# EAGLE schematic Stepper motor board (EAGLE 9.6.2)
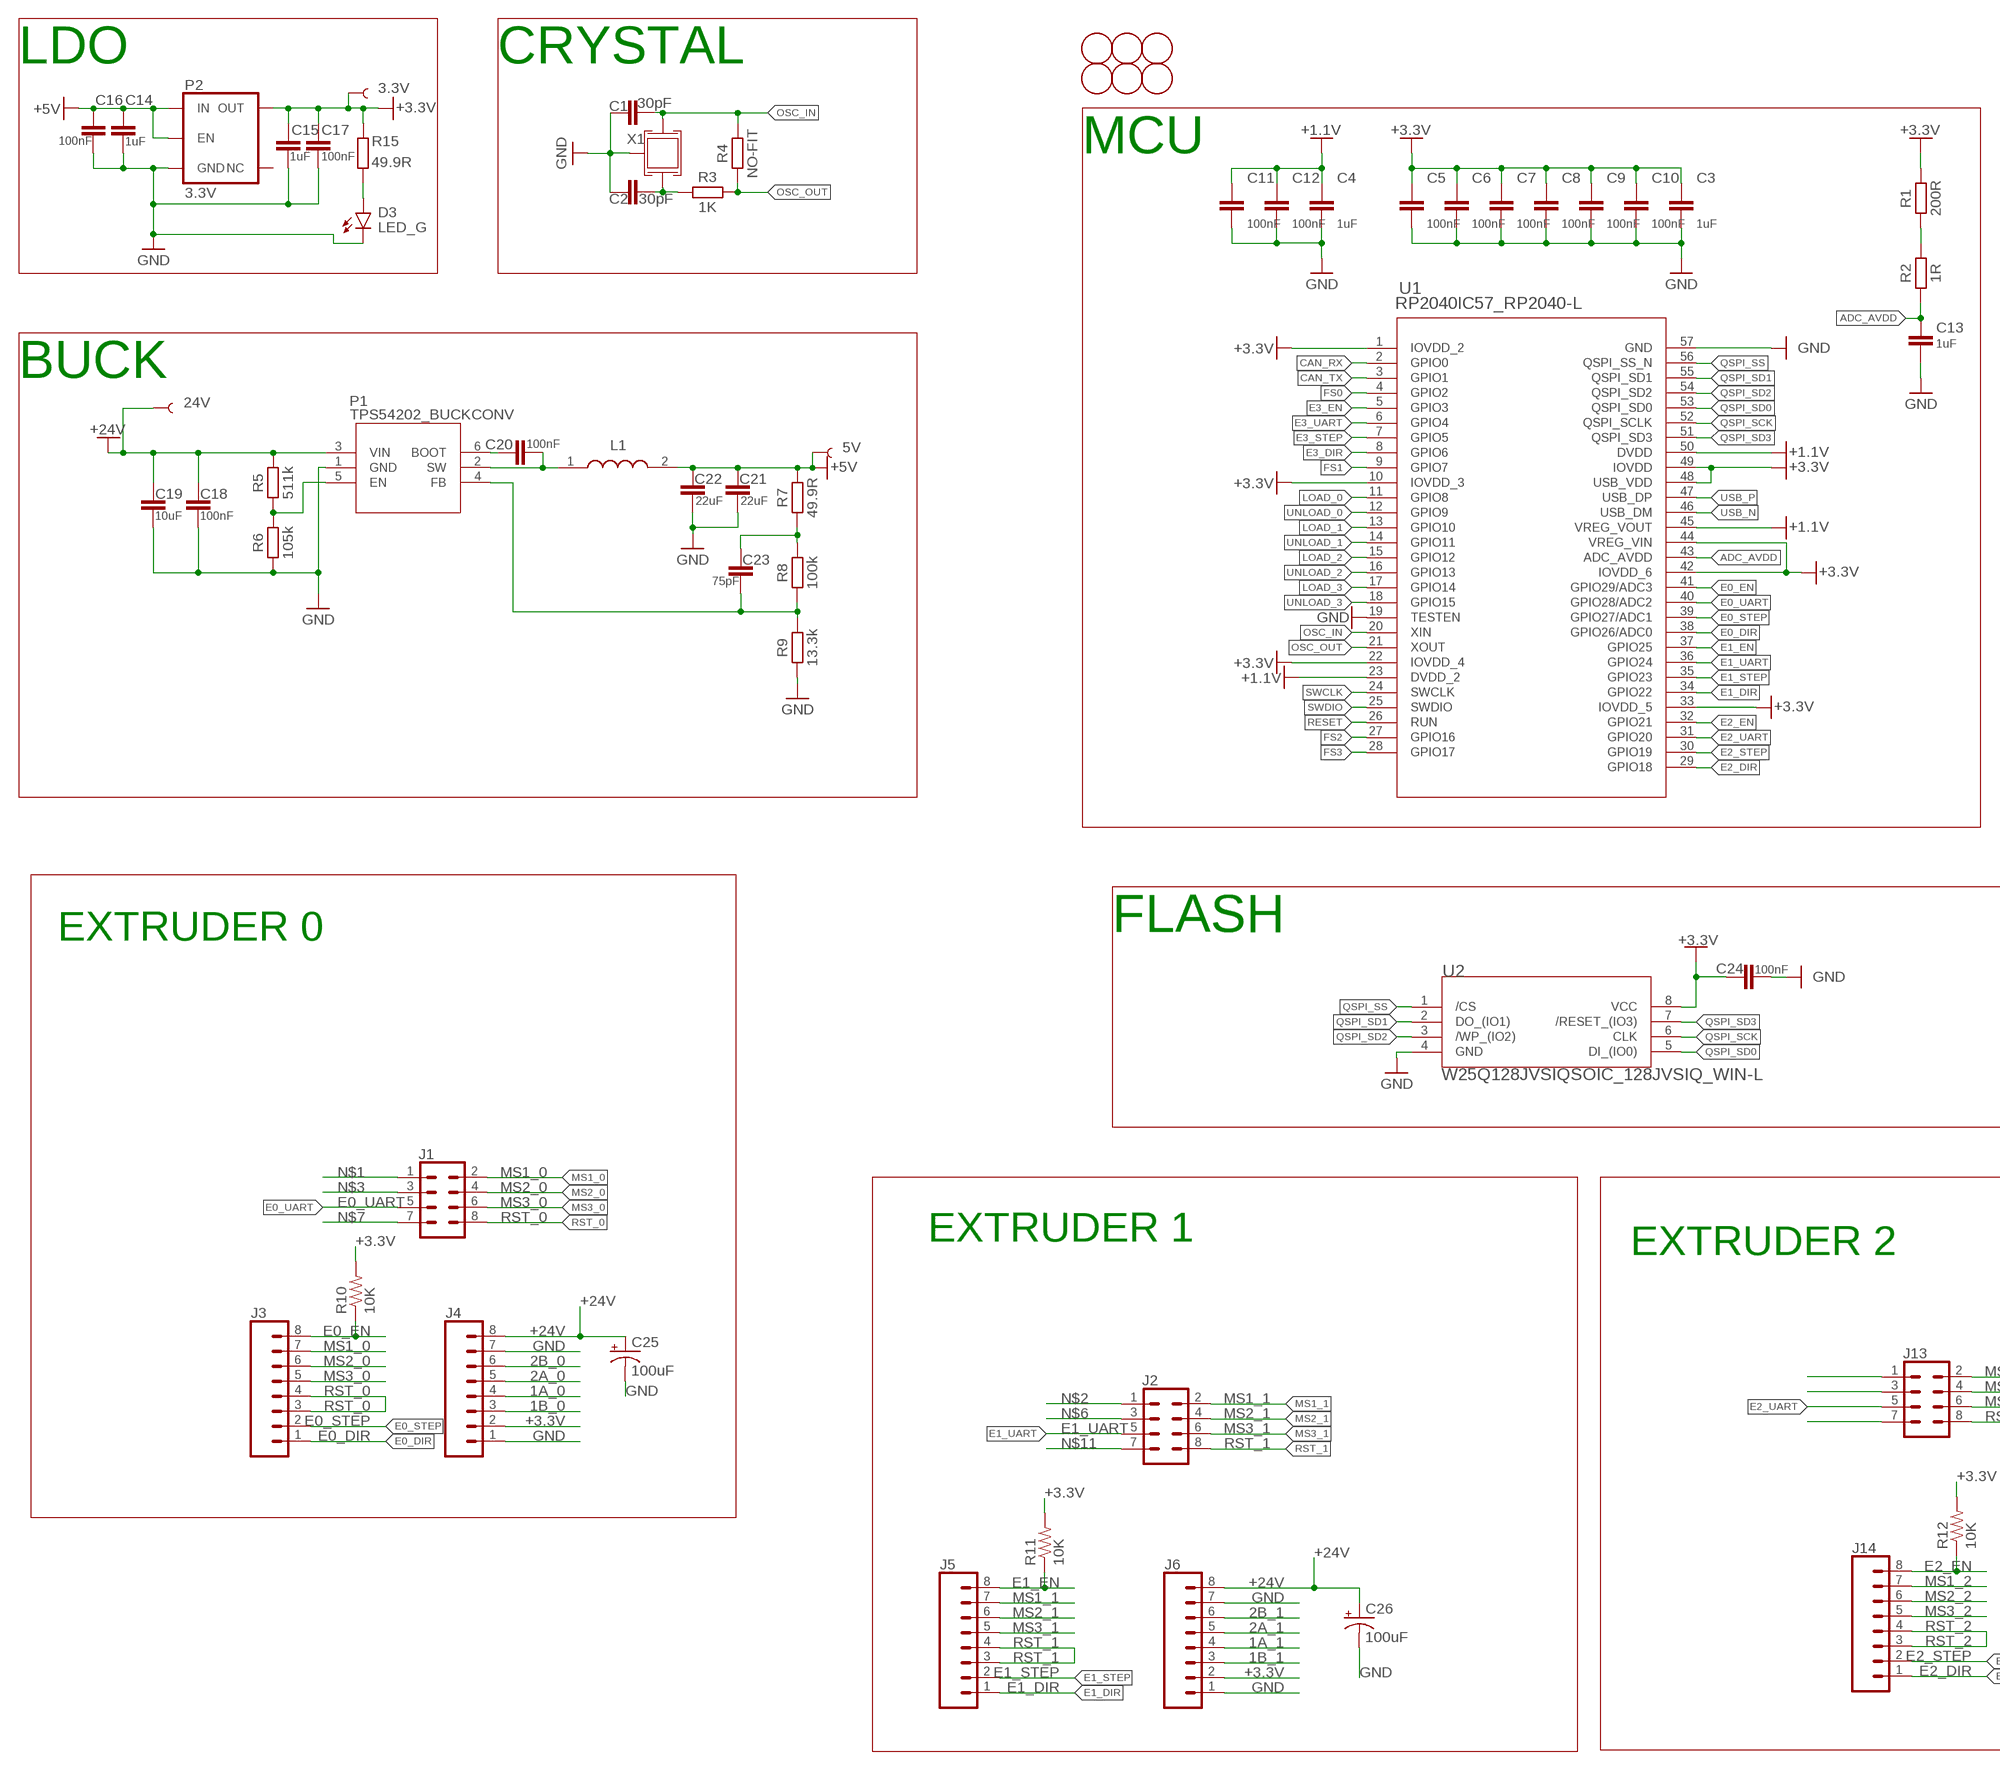
[diagram p0: schematic, sheet 1, part 1 of 2]
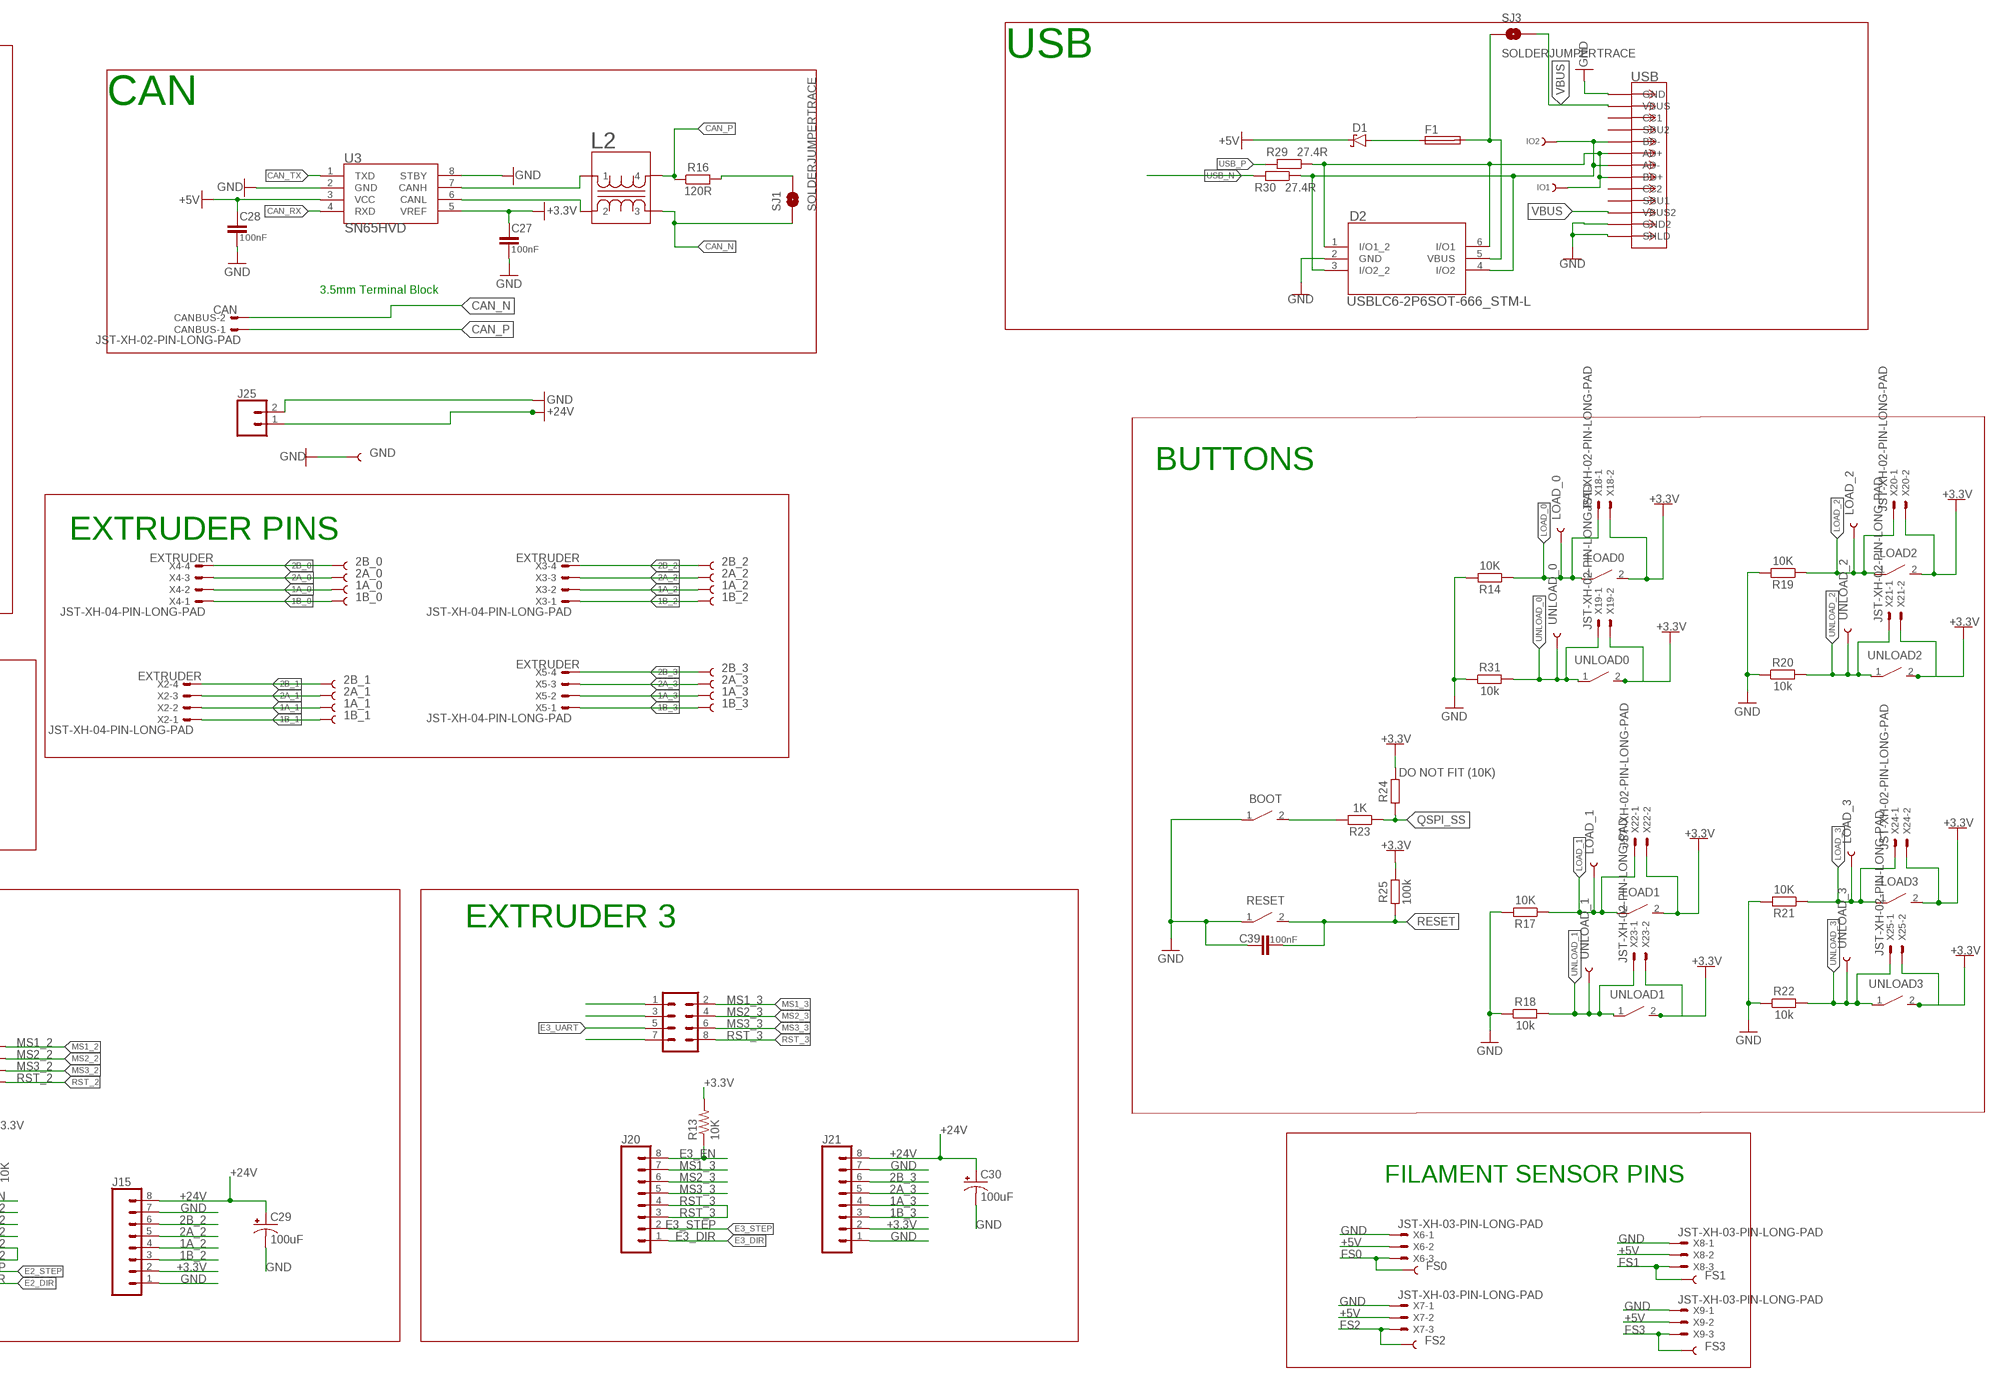
[diagram p1: schematic, sheet 1, part 2 of 2]

## Parts
1A_0  TEST-POINT3X4  [PAD.03X.04]
1A_1  TEST-POINT3X4  [PAD.03X.04]
1A_2  TEST-POINT3X4  [PAD.03X.04]
1A_3  TEST-POINT3X4  [PAD.03X.04]
1B_0  TEST-POINT3X4  [PAD.03X.04]
1B_1  TEST-POINT3X4  [PAD.03X.04]
1B_2  TEST-POINT3X4  [PAD.03X.04]
1B_3  TEST-POINT3X4  [PAD.03X.04]
2A_0  TEST-POINT3X4  [PAD.03X.04]
2A_1  TEST-POINT3X4  [PAD.03X.04]
2A_2  TEST-POINT3X4  [PAD.03X.04]
2A_3  TEST-POINT3X4  [PAD.03X.04]
2B_0  TEST-POINT3X4  [PAD.03X.04]
2B_1  TEST-POINT3X4  [PAD.03X.04]
2B_2  TEST-POINT3X4  [PAD.03X.04]
2B_3  TEST-POINT3X4  [PAD.03X.04]
3.3V  TEST-POINT3X4  [PAD.03X.04]
5V  TEST-POINT3X4  [PAD.03X.04]
24V  TEST-POINT3X4  [PAD.03X.04]
BOOT  B3U-1000P(M)-B  B3U-X000B3U-1000P(M)-B1000P(M)-B  [B3U-1000P(M)-B]
C1  30pF  C_CHIP-0402(1005-METRIC)  [CAPC1005X60]
C2  30pF  C_CHIP-0402(1005-METRIC)  [CAPC1005X60]
C3  1uF  C_CHIP-0402(1005-METRIC)  [CAPC1005X60]
C4  1uF  C_CHIP-0402(1005-METRIC)  [CAPC1005X60]
C5  100nF  C_CHIP-0402(1005-METRIC)  [CAPC1005X60]
C6  100nF  C_CHIP-0402(1005-METRIC)  [CAPC1005X60]
C7  100nF  C_CHIP-0402(1005-METRIC)  [CAPC1005X60]
C8  100nF  C_CHIP-0402(1005-METRIC)  [CAPC1005X60]
C9  100nF  C_CHIP-0402(1005-METRIC)  [CAPC1005X60]
C10  100nF  C_CHIP-0402(1005-METRIC)  [CAPC1005X60]
C11  100nF  C_CHIP-0402(1005-METRIC)  [CAPC1005X60]
C12  100nF  C_CHIP-0402(1005-METRIC)  [CAPC1005X60]
C13  1uF  C_CHIP-0402(1005-METRIC)  [CAPC1005X60]
C14  1uF  C_CHIP-0402(1005-METRIC)  [CAPC1005X60]
C15  1uF  C_CHIP-0402(1005-METRIC)  [CAPC1005X60]
C16  100nF  C_CHIP-0402(1005-METRIC)  [CAPC1005X60]
C17  100nF  C_CHIP-0402(1005-METRIC)  [CAPC1005X60]
C18  100nF  C_CHIP-0402(1005-METRIC)  [CAPC1005X60]
C19  10uF  C_CHIP-0603(1608-METRIC)  [CAPC1608X85]
C20  100nF  C_CHIP-0402(1005-METRIC)  [CAPC1005X60]
C21  22uF  C_CHIP-0805(2012-METRIC)  [CAPC2012X110]
C22  22uF  C_CHIP-0805(2012-METRIC)  [CAPC2012X110]
C23  75pF  C_CHIP-0402(1005-METRIC)  [CAPC1005X60]
C24  100nF  C_CHIP-0402(1005-METRIC)  [CAPC1005X60]
C25  100uF  100UF-POLAR-25V-20%(ELEC)  [PANASONIC_D]
C26  100uF  100UF-POLAR-25V-20%(ELEC)  [PANASONIC_D]
C27  100nF  C_CHIP-0402(1005-METRIC)  [CAPC1005X60]
C28  100nF  C_CHIP-0402(1005-METRIC)  [CAPC1005X60]
C29  100uF  100UF-POLAR-25V-20%(ELEC)  [PANASONIC_D]
C30  100uF  100UF-POLAR-25V-20%(ELEC)  [PANASONIC_D]
C39  100nF  C_CHIP-0402(1005-METRIC)  [CAPC1005X60]
CANBUS  JST-XH-02-PIN-LONG-PAD  [JST-XH-02-PACKAGE-LONG-PAD]
D1  MBR0520LT1G  SCHOTTKY_MBR0520LT1GDO-219  [SODFL3718X115]
D2  USBLC6-2P6SOT-666_STM-L  [SOT-666_STM-L]
D3  LED_G  CHIP-FLAT-G_0603-0.35MM  [LEDC1608X35N_FLAT-G]
F1  FUSE_CHIP-0603(1608-METRIC)  [FUSC1608X60N]
FD1  FIDUCIAL  [FIDUCIAL_1MM]
FD2  FIDUCIAL  [FIDUCIAL_1MM]
FD3  FIDUCIAL  [FIDUCIAL_1MM]
FD4  FIDUCIAL  [FIDUCIAL_1MM]
FD5  FIDUCIAL  [FIDUCIAL_1MM]
FD6  FIDUCIAL  [FIDUCIAL_1MM]
FS0  TEST-POINT3X4  [PAD.03X.04]
FS1  TEST-POINT3X4  [PAD.03X.04]
FS2  TEST-POINT3X4  [PAD.03X.04]
FS3  TEST-POINT3X4  [PAD.03X.04]
GND  TEST-POINT3X4  [PAD.03X.04]
IO1  TEST-POINT3  [PAD.03X.03]
IO2  TEST-POINT3  [PAD.03X.03]
J1  CONN_04X2  [2X4]
J2  CONN_04X2  [2X4]
J3  CONN_08"  [1X08]
J4  CONN_08"  [1X08]
J5  CONN_08"  [1X08]
J6  CONN_08"  [1X08]
J13  CONN_04X2  [2X4]
J14  CONN_08"  [1X08]
J15  CONN_08"  [1X08]
J19  CONN_04X2  [2X4]
J20  CONN_08"  [1X08]
J21  CONN_08"  [1X08]
J25  CONN_023.5MM  [SCREWTERMINAL-3.5MM-2]
L1  ASPI-0630HI-100M-T157X7X4  [SMDRI74-680MT]
L2  ACM2012  ACM2012-201-2P-T002ACM2012_TDK  [ACM2012_TDK]
LOAD0  B3U-1000P(M)-B  B3U-X000B3U-1000P(M)-B1000P(M)-B  [B3U-1000P(M)-B]
LOAD1  B3U-1000P(M)-B  B3U-X000B3U-1000P(M)-B1000P(M)-B  [B3U-1000P(M)-B]
LOAD2  B3U-1000P(M)-B  B3U-X000B3U-1000P(M)-B1000P(M)-B  [B3U-1000P(M)-B]
LOAD3  B3U-1000P(M)-B  B3U-X000B3U-1000P(M)-B1000P(M)-B  [B3U-1000P(M)-B]
LOAD_0  TEST-POINT3X4  [PAD.03X.04]
LOAD_1  TEST-POINT3X4  [PAD.03X.04]
LOAD_2  TEST-POINT3X4  [PAD.03X.04]
LOAD_3  TEST-POINT3X4  [PAD.03X.04]
P1  TPS54202_BUCKCONV  [SOT-23-6]
P2  3.3V  V_REG_AP2112K-3.3V  [SOT23-5]
R1  200R  R_CHIP-0402(1005-METRIC)  [RESC1005X40]
R2  1R  R_CHIP-0402(1005-METRIC)  [RESC1005X40]
R3  1K  R_CHIP-0402(1005-METRIC)  [RESC1005X40]
R4  NO-FIT  R_CHIP-0402(1005-METRIC)  [RESC1005X40]
R5  511k  R_CHIP-0402(1005-METRIC)  [RESC1005X40]
R6  105k  R_CHIP-0402(1005-METRIC)  [RESC1005X40]
R7  49.9R  R_CHIP-0402(1005-METRIC)  [RESC1005X40]
R8  100k  R_CHIP-0402(1005-METRIC)  [RESC1005X40]
R9  13.3k  R_CHIP-0402(1005-METRIC)  [RESC1005X40]
R10  10K  10KOHM1/10W1%(0603)0603  [0603-RES]
R11  10K  10KOHM1/10W1%(0603)0603  [0603-RES]
R12  10K  10KOHM1/10W1%(0603)0603  [0603-RES]
R13  10K  10KOHM1/10W1%(0603)0603  [0603-RES]
R14  10K  R_CHIP-0402(1005-METRIC)  [RESC1005X40]
R15  49.9R  R_CHIP-0402(1005-METRIC)  [RESC1005X40]
R16  120R  R_CHIP-0402(1005-METRIC)  [RESC1005X40]
R17  10K  R_CHIP-0402(1005-METRIC)  [RESC1005X40]
R18  10k  R_CHIP-0402(1005-METRIC)  [RESC1005X40]
R19  10K  R_CHIP-0402(1005-METRIC)  [RESC1005X40]
R20  10k  R_CHIP-0402(1005-METRIC)  [RESC1005X40]
R21  10K  R_CHIP-0402(1005-METRIC)  [RESC1005X40]
R22  10k  R_CHIP-0402(1005-METRIC)  [RESC1005X40]
R23  1K  R_CHIP-0402(1005-METRIC)  [RESC1005X40]
R24  DO NOT FIT (10K)  R_CHIP-0402(1005-METRIC)  [RESC1005X40]
R25  100k  R_CHIP-0402(1005-METRIC)  [RESC1005X40]
R29  27.4R  R_CHIP-0402(1005-METRIC)  [RESC1005X40]
R30  27.4R  R_CHIP-0402(1005-METRIC)  [RESC1005X40]
R31  10k  R_CHIP-0402(1005-METRIC)  [RESC1005X40]
RESET  B3U-1000P(M)-B  B3U-X000B3U-1000P(M)-B1000P(M)-B  [B3U-1000P(M)-B]
SJ1  SOLDERJUMPERTRACE  [SJ_2S-TRACE]
SJ3  SOLDERJUMPERTRACE  [SJ_2S-TRACE]
U1  RP2040IC57_RP2040-L  [IC57_RP2040-L]
U2  W25Q128JVSIQSOIC_128JVSIQ_WIN-L  [SOIC_128JVSIQ_WIN-L]
U3  SN65HVD  SN65HVD1050DRD8-L  [D8-L]
UNLOAD0  B3U-1000P(M)-B  B3U-X000B3U-1000P(M)-B1000P(M)-B  [B3U-1000P(M)-B]
UNLOAD1  B3U-1000P(M)-B  B3U-X000B3U-1000P(M)-B1000P(M)-B  [B3U-1000P(M)-B]
UNLOAD2  B3U-1000P(M)-B  B3U-X000B3U-1000P(M)-B1000P(M)-B  [B3U-1000P(M)-B]
UNLOAD3  B3U-1000P(M)-B  B3U-X000B3U-1000P(M)-B1000P(M)-B  [B3U-1000P(M)-B]
UNLOAD_0  TEST-POINT3X4  [PAD.03X.04]
UNLOAD_1  TEST-POINT3X4  [PAD.03X.04]
UNLOAD_2  TEST-POINT3X4  [PAD.03X.04]
UNLOAD_3  TEST-POINT3X4  [PAD.03X.04]
USB  USB-C(KH-TYPE-C-16P)  [CONN12_KH-TYPE-C-16P]
X1  CRYSTAL_TAXM12M4RLBDDT2T_3225  [CRYSTAL_3225]
X2  JST-XH-04-PIN-LONG-PAD  [JST-XH-04-PACKAGE-LONG-PAD]
X3  JST-XH-04-PIN-LONG-PAD  [JST-XH-04-PACKAGE-LONG-PAD]
X4  JST-XH-04-PIN-LONG-PAD  [JST-XH-04-PACKAGE-LONG-PAD]
X5  JST-XH-04-PIN-LONG-PAD  [JST-XH-04-PACKAGE-LONG-PAD]
X6  JST-XH-03-PIN-LONG-PAD  [JST-XH-03-PACKAGE-LONG-PAD]
X7  JST-XH-03-PIN-LONG-PAD  [JST-XH-03-PACKAGE-LONG-PAD]
X8  JST-XH-03-PIN-LONG-PAD  [JST-XH-03-PACKAGE-LONG-PAD]
X9  JST-XH-03-PIN-LONG-PAD  [JST-XH-03-PACKAGE-LONG-PAD]
X18  JST-XH-02-PIN-LONG-PAD  [JST-XH-02-PACKAGE-LONG-PAD]
X19  JST-XH-02-PIN-LONG-PAD  [JST-XH-02-PACKAGE-LONG-PAD]
X20  JST-XH-02-PIN-LONG-PAD  [JST-XH-02-PACKAGE-LONG-PAD]
X21  JST-XH-02-PIN-LONG-PAD  [JST-XH-02-PACKAGE-LONG-PAD]
X22  JST-XH-02-PIN-LONG-PAD  [JST-XH-02-PACKAGE-LONG-PAD]
X23  JST-XH-02-PIN-LONG-PAD  [JST-XH-02-PACKAGE-LONG-PAD]
X24  JST-XH-02-PIN-LONG-PAD  [JST-XH-02-PACKAGE-LONG-PAD]
X25  JST-XH-02-PIN-LONG-PAD  [JST-XH-02-PACKAGE-LONG-PAD]

## Nets
1A_0: 1A_0.P$1 J4.4 X4.2
1A_1: 1A_1.P$1 J6.4 X2.2
1A_2: 1A_2.P$1 J15.4 X3.2
1A_3: 1A_3.P$1 J21.4 X5.2
1B_0: 1B_0.P$1 J4.3 X4.1
1B_1: 1B_1.P$1 J6.3 X2.1
1B_2: 1B_2.P$1 J15.3 X3.1
1B_3: 1B_3.P$1 J21.3 X5.1
2A_0: 2A_0.P$1 J4.5 X4.3
2A_1: 2A_1.P$1 J6.5 X2.3
2A_2: 2A_2.P$1 J15.5 X3.3
2A_3: 2A_3.P$1 J21.5 X5.3
2B_0: 2B_0.P$1 J4.6 X4.4
2B_1: 2B_1.P$1 J6.6 X2.4
2B_2: 2B_2.P$1 J15.6 X3.4
2B_3: 2B_3.P$1 J21.6 X5.4
+1.1V [POWER]: C4.1 C11.1 C12.1 U1.23(DVDD_2) U1.45(VREG_VOUT) U1.50(DVDD)
+3.3V [POWER]: 3.3V.P$1 C3.1 C5.1 C6.1 C7.1 C8.1 C9.1 C10.1 C15.1 C17.1 C24.1 C27.1 J4.2 J6.2 J15.2 J21.2 LOAD0.2 LOAD1.2 LOAD2.2 LOAD3.2 P2.5(OUT) R1.2 R10.2 R11.2 R12.2 R13.2 R15.2 R24.2 R25.2 U1.1(IOVDD_2) U1.10(IOVDD_3) U1.22(IOVDD_4) U1.33(IOVDD_5) U1.42(IOVDD_6) U1.44(VREG_VIN) U1.48(USB_VDD) U1.49(IOVDD) U2.8(VCC) U3.5(VREF) UNLOAD0.2 UNLOAD1.2 UNLOAD2.2 UNLOAD3.2 X18.2 X19.2 X20.2 X21.2 X22.2 X23.2 X24.2 X25.2
+5V [POWER]: 5V.P$1 C14.1 C16.1 C21.1 C22.1 C28.1 D1.1(C) L1.2 P2.1(IN) P2.3(EN) R7.2 U3.3(VCC) X6.2 X7.2 X8.2 X9.2
+24V [POWER]: 24V.P$1 C18.1 C19.1 C25.+ C26.+ C29.+ C30.+ J4.8 J6.8 J15.8 J21.8 J25.1 P1.3(VIN) R5.2
ADC_AVDD: C13.1 R2.1 U1.43(ADC_AVDD)
ADC_R: R1.1 R2.2
BCBOOT: C20.1 P1.6(BOOT)
CAN1_N [DIFF]: L2.2 U3.6(CANL)
CAN1_P [DIFF]: L2.1 U3.7(CANH)
CAN_N [DIFF]: CANBUS.2 L2.3 SJ1.1
CAN_P [DIFF]: CANBUS.1 L2.4 R16.1
CAN_RX: U1.2(GPIO0) U3.4(RXD)
CAN_TX: U1.3(GPIO1) U3.1(TXD)
CNT: R16.2 SJ1.2
E0_DIR: J3.1 U1.38(GPIO26/ADC0)
E0_EN: J3.8 R10.1 U1.41(GPIO29/ADC3)
E0_STEP: J3.2 U1.39(GPIO27/ADC1)
E0_UART: J1.5 U1.40(GPIO28/ADC2)
E1_DIR: J5.1 U1.34(GPIO22)
E1_EN: J5.8 R11.1 U1.37(GPIO25)
E1_STEP: J5.2 U1.35(GPIO23)
E1_UART: J2.5 U1.36(GPIO24)
E2_DIR: J14.1 U1.29(GPIO18)
E2_EN: J14.8 R12.1 U1.32(GPIO21)
E2_STEP: J14.2 U1.30(GPIO19)
E2_UART: J13.5 U1.31(GPIO20)
E3_DIR: J20.1 U1.8(GPIO6)
E3_EN: J20.8 R13.1 U1.5(GPIO3)
E3_STEP: J20.2 U1.7(GPIO5)
E3_UART: J19.5 U1.6(GPIO4)
FS0: FS0.P$1 U1.4(GPIO2) X6.3
FS1: FS1.P$1 U1.9(GPIO7) X8.3
FS2: FS2.P$1 U1.27(GPIO16) X7.3
FS3: FS3.P$1 U1.28(GPIO17) X9.3
GND [POWER]: BOOT.1 C1.2 C2.1 C3.2 C4.2 C5.2 C6.2 C7.2 C8.2 C9.2 C10.2 C11.2 C12.2 C13.2 C14.2 C15.2 C16.2 C17.2 C18.2 C19.2 C21.2 C22.2 C24.2 C25.- C26.- C27.2 C28.2 C29.- C30.- C39.1 D2.2(GND) D3.C GND.P$1 J4.1 J4.7 J6.1 J6.7 J15.1 J15.7 J21.1 J21.7 J25.2 P1.1(GND) P2.2(GND) R6.1 R9.1 R14.2 R17.2 R18.1 R19.2 R20.1 R21.2 R22.1 R31.1 RESET.1 U1.19(TESTEN) U1.57(GND) U2.4(GND) U3.2(GND) U3.8(STBY) USB.1(GND) USB.12(GND2) USB.13(SHLD) USB.14(SHLD) USB.15(SHLD) USB.16(SHLD) USB.18(SHLD) USB.19(SHLD) USB.20(SHLD) USB.21(SHLD) USB.24(SHLD) USB.25(SHLD) USB.26(SHLD) USB.27(SHLD) USB.28(SHLD) USB.29(SHLD) USB.37(SHLD) USB.39(SHLD) USB.41(SHLD) USB.43(SHLD) X1.P$2(GND) X1.P$4(GND) X6.1 X7.1 X8.1 X9.1
LDOLED: D3.A R15.1
LOAD_0: LOAD0.1 LOAD_0.P$1 R14.1 U1.11(GPIO8) X18.1
LOAD_1: LOAD1.1 LOAD_1.P$1 R17.1 U1.13(GPIO10) X22.1
LOAD_2: LOAD2.1 LOAD_2.P$1 R19.1 U1.15(GPIO12) X20.1
LOAD_3: LOAD3.1 LOAD_3.P$1 R21.1 U1.17(GPIO14) X24.1
MS1_0: J1.2 J3.7
MS1_1: J2.2 J5.7
MS1_2: J13.2 J14.7
MS1_3: J19.2 J20.7
MS2_0: J1.4 J3.6
MS2_1: J2.4 J5.6
MS2_2: J13.4 J14.6
MS2_3: J19.4 J20.6
MS3_0: J1.6 J3.5
MS3_1: J2.6 J5.5
MS3_2: J13.6 J14.5
MS3_3: J19.6 J20.5
N$1: J1.1
N$2: J2.1
N$3: J1.3
N$4: J13.1
N$6: J2.3
N$7: J1.7
N$8: J13.3
N$11: J2.7
N$12: J13.7
N$14: J19.1
N$15: J19.3
N$17: J19.7
OSC_IN: C1.1 R4.2 U1.20(XIN) X1.P$1(P1)
OSC_OUT: R3.2 R4.1 U1.21(XOUT)
QSPI_SCK: U1.52(QSPI_SCLK) U2.6(CLK)
QSPI_SD0: U1.53(QSPI_SD0) U2.5(DI_(IO0))
QSPI_SD1: U1.55(QSPI_SD1) U2.2(DO_(IO1))
QSPI_SD2: U1.54(QSPI_SD2) U2.3(/WP_(IO2))
QSPI_SD3: U1.51(QSPI_SD3) U2.7(/RESET_(IO3))
QSPI_SS: R23.1 R24.1 U1.56(QSPI_SS_N) U2.1(/CS)
RESET: C39.2 R25.1 RESET.2 U1.26(RUN)
RST_0: J1.8 J3.3 J3.4
RST_1: J2.8 J5.3 J5.4
RST_2: J13.8 J14.3 J14.4
RST_3: J19.8 J20.3 J20.4
SWB: BOOT.2 R23.2
SWCLK: U1.24(SWCLK)
SWDIO: U1.25(SWDIO)
UNLOAD_0: R31.2 U1.12(GPIO9) UNLOAD0.1 UNLOAD_0.P$1 X19.1
UNLOAD_1: R18.2 U1.14(GPIO11) UNLOAD1.1 UNLOAD_1.P$1 X23.1
UNLOAD_2: R20.2 U1.16(GPIO13) UNLOAD2.1 UNLOAD_2.P$1 X21.1
UNLOAD_3: R22.2 U1.18(GPIO15) UNLOAD3.1 UNLOAD_3.P$1 X25.1
USB1_N [DIFF]: D2.3(I/O2_2) D2.4(I/O2) IO2.P$1 R30.1 USB.5(BD-) USB.7(AD-)
USB1_P [DIFF]: D2.1(I/O1_2) D2.6(I/O1) IO1.P$1 R29.1 USB.6(AD+) USB.8(BD+)
USB_N [DIFF]: R30.2 U1.46(USB_DM)
USB_P [DIFF]: R29.2 U1.47(USB_DP)
VBUS [POWER]: SJ3.2 USB.2(VBUS) USB.11(VBUS2)
VBUS1 [POWER]: D2.5(VBUS) F1.2 SJ3.1
VBUS3 [POWER]: D1.2(A) F1.1
VRC: C23.1 R7.1 R8.2
VREGEN: P1.5(EN) R5.1 R6.2
VREGFB: C23.2 P1.4(FB) R8.1 R9.2
VREGO: C20.2 L1.1 P1.2(SW)
XR: C2.2 R3.1 X1.P$3(P2)
Unconnected: P2.4(NC) USB.3(CC1) USB.4(SBU2) USB.9(CC2) USB.10(SBU1)

## Notes on the sheet
- LDO | CRYSTAL
- USB
- MCU
- CAN
- BUCK
- 3.5mm Terminal Block
- BUTTONS
- EXTRUDER PINS
- EXTRUDER 0 | FLASH
- EXTRUDER 3
- EXTRUDER 1
- EXTRUDER 2
- FILAMENT SENSOR PINS

## Library data of the parts
1A_0 1A_1-1A_3 1B_0 1B_1-1B_3 2A_0 2A_1-2A_3 2B_0 2B_1-2B_3 3.3V 5V 24V FS0 FS1-FS3 GND IO1 IO2 LOAD_0 LOAD_1-LOAD_3 UNLOAD_0 UNLOAD_1-UNLOAD_3 = SparkFun-Connectors:TEST-POINT: SparkFun Test Points Bare copper test points for troubleshooting or In-Circuit-Testing. These are used by our Production team for verifying production board runs using pogo-pins on test beds. SparkFun Products: SparkFun LSM9DS1 Breakout <https://www.sparkfun.com/products/13284> SparkFun PSOC <https://www.sparkfun.com/products/13714> SparkFun Load Cell Amplifier <https://www.sparkfun.com/products/13879>
BOOT LOAD0 LOAD1-LOAD3 RESET UNLOAD0 UNLOAD1-UNLOAD3 = Switch:B3U-X000: Ultra-small Tactile Switch Contact form : SPST-NO Datasheet <https://omronfs.omron.com/en_US/ecb/products/pdf/en-b3u.pdf>; CATEGORY: SWITCH; DESCRIPTION: Ultra-small Surface-mounting Tactile Switches with High Contact Reliability; LCSCPN#: C231329; MANUFACTURER: OMRON; OPERATING_TEMPERATURE: -25°C to +70°C at 60%RH max; PART_STATUS: ACTIVE; SERIES: B3U; TYPE: Tactile
C1 C2 = Fracktal Misc Lib:C: Capacitor - Generic; CATEGORY: Capacitor; LCSCPN#: C1570
C3 C4 C13-C15 = Fracktal Misc Lib:C: Capacitor - Generic; CATEGORY: Capacitor; LCSCPN#: C52923
C5-C12 C16-C18 C20 C24 C27 C28 C39 = Fracktal Misc Lib:C: Capacitor - Generic; CATEGORY: Capacitor; LCSCPN#: C307331
C19 = Fracktal Misc Lib:C: Capacitor - Generic; CATEGORY: Capacitor; LCSCPN#: C194427
C21 C22 = Fracktal Misc Lib:C: Capacitor - Generic; CATEGORY: Capacitor; LCSCPN#: C338080
C23 = Fracktal Misc Lib:C: Capacitor - Generic; CATEGORY: Capacitor; LCSCPN#: C37809
C25 C26 C29 C30 = Fracktal_Misc_Lib_v26:100UF-POLAR: 100µF polarized capacitors A capacitor is a passive two-terminal electrical component used to store electrical energy temporarily in an electric field.; PROD_ID: CAP-12547
CANBUS X18-X25 = Rembrandt Electronics - JST XH Connectors v1-0:JST-XH-02-PIN: JST XH Connector 2 Pin Wire to board connector. Pitch: 2,54 mm, (0.100") Number of pins: 2 Created by Rembrandt Electronics www.rembrandtelectronics.com
D1 = Diode:SCHOTTKY_: Schottky Diode - Popular parts; CATEGORY: Diode; DESCRIPTION: DIODE SCHOTTKY 20V 500MA SOD123; MANUFACTURER: ON Semiconductor; MPN: MBR0520LT1G; SUB-CATEGORY: Schottky
D2 = 2023-04-02_04-17-07_Library:USBLC6-2P6; COPYRIGHT: Copyright (C) 2023 Ultra Librarian. All rights reserved.; LCSCPN#: C2827693; MANUFACTURER_PART_NUMBER: USBLC6-2P6; MFR_NAME: STMicroelectronics
D3 = LED:CHIP-FLAT-G; CATEGORY: LED; COLOR: GREEN; DESCRIPTION: CHIP LED FLAT; LCSCPN#: C72043; SUB-CATEGORY: CHIP; TYPE: FLAT_TOP; VALUE: LED_GREEN
F1 = Circuit-Protection:FUSE: Fuse - Generic; CATEGORY: Circuit-Protection; LCSCPN#: C261937; SUB-CATEGORY: Fuse
FD1-FD6 = CDC Library:FIDUCIAL: For use by pick and place machines to calibrate the vision/machine, 1mm By microbuilder.eu
J1 J2 J13 J19 = SparkFun-Connectors:CONN_04X2: Multi connection point. Often used as Generic Header-pin footprint for 0.1 inch spaced/style header connections On any of the 0.1 inch spaced packages, you can populate with these: Break Away Headers - Straight <https://www.sparkfun.com/products/116> (PRT-00116) Break Away Male Headers - Right Angle <https://www.sparkfun.com/products/553> (PRT-00553) Female Headers <https://www.sparkfun.com/products/115> (PRT-00115) Break Away Headers - Machine Pin <https://www.sparkfun.com/products/117> (PRT-00117) Break Away Female Headers - Swiss Machine Pin <https://www.sparkfun.com/products/743> (PRT-00743)
J3-J6 J14 J15 J20 J21 = SparkFun-Connectors:CONN_08: Multi connection point. Often used as Generic Header-pin footprint for 0.1 inch spaced/style header connections On any of the 0.1 inch spaced packages, you can populate with these: Break Away Headers - Straight <https://www.sparkfun.com/products/116> (PRT-00116) Break Away Male Headers - Right Angle <https://www.sparkfun.com/products/553> (PRT-00553) Female Headers <https://www.sparkfun.com/products/115> (PRT-00115) Break Away Headers - Machine Pin <https://www.sparkfun.com/products/117> (PRT-00117) Break Away Female Headers - Swiss Machine Pin <https://www.sparkfun.com/products/743> (PRT-00743) Arduino Stackable Header - 8 Pin <https://www.sparkfun.com/products/9279> (PRT-09279) For SCREWTERMINALS and SPRING TERMINALS visit here: Screw Terimnals on SparkFun.com <https://www.sparkfun.com/search/results?term=Screw+Terminals> (5mm/3.5mm/2.54mm spacing) This device is also useful as a general connection point to wire up your design to another part of your project. Our various solder wires solder well into these plated through hole pads. Hook-Up Wire - Assortment (Stranded, 22 AWG) <https://www.sparkfun.com/products/11375> (PRT-11375) Hook-Up Wire - Assortment (Solid Core, 22 AWG) <https://www.sparkfun.com/products/11367> (PRT-11367) View the entire wire category on our website here <https://www.sparkfun.com/categories/141> Special notes: Molex polarized connector foot print use with SKU : PRT-08231 with associated crimp pins and housings. 1MM SMD Version SKU: PRT-10208 NOTES ON THE VARIANTS LOCK and LOCK_LONGPADS... This footprint was designed to help hold the alignment of a through-hole component (i.e. 6-pin header) while soldering it into place. You may notice that each hole has been shifted either up or down by 0.005 of an inch from it's more standard position (which is a perfectly straight line). This slight alteration caused the pins (the squares in the middle) to touch the edges of the holes. Because they are alternating, it causes a "brace" to hold the component in place. 0.005 has proven to be the perfect amount of "off-center" position when using our standard breakaway headers. Although looks a little odd when you look at the bare footprint, once you have a header in there, the alteration is very hard to notice. Also,if you push a header all the way into place, it is covered up entirely on the bottom side.; PROD_ID: CONN-08438
J25 = SparkFun-Connectors:CONN_02: Multi connection point. Often used as Generic Header-pin footprint for 0.1 inch spaced/style header connections On any of the 0.1 inch spaced packages, you can populate with these: Break Away Headers - Straight <https://www.sparkfun.com/products/116> (PRT-00116) Break Away Male Headers - Right Angle <https://www.sparkfun.com/products/553> (PRT-00553) Female Headers <https://www.sparkfun.com/products/115> (PRT-00115) Break Away Headers - Machine Pin <https://www.sparkfun.com/products/117> (PRT-00117) Break Away Female Headers - Swiss Machine Pin <https://www.sparkfun.com/products/743> (PRT-00743) For SCREWTERMINALS and SPRING TERMINALS visit here: Screw Terimnals on SparkFun.com <https://www.sparkfun.com/search/results?term=Screw+Terminals> (5mm/3.5mm/2.54mm spacing) This device is also useful as a general connection point to wire up your design to another part of your project. Our various solder wires solder well into these plated through hole pads. Hook-Up Wire - Assortment (Stranded, 22 AWG) <https://www.sparkfun.com/products/11375> (PRT-11375) Hook-Up Wire - Assortment (Solid Core, 22 AWG) <https://www.sparkfun.com/products/11367> (PRT-11367) View the entire wire category on our website here <https://www.sparkfun.com/categories/141> Special notes: Molex polarized connector foot print use with: PRT-08233 with associated crimp pins and housings. 2.54_SCREWTERM for use with PRT-10571. 3.5mm Screw Terminal footprints for PRT-08084 5mm Screw Terminal footprints for use with PRT-08432; PROD_ID: CONN-08399
L1 = Fracktal Misc Lib:ASPI-0630HI-100M-T15: Inductor Power Molded Wirewound 10uH 20% 3A 105mOhm DCR T/R Source: Datasheet <https://www.arrow.com/en/products/aspi-0630hi-100m-t15/abracon>; LCSCPN#: C3000391
L2 = 2023-04-02_14-21-16_Library:ACM2012-201-2P-T002; COPYRIGHT: Copyright (C) 2023 Ultra Librarian. All rights reserved.; LCSCPN#: C3029258; MANUFACTURER_PART_NUMBER: ACM2012-201-2P-T002; MFR_NAME: TDK
P1 = Fracktal Misc Lib:TPS54202_BUCKCONV; LCSCPN#: C191884
P2 = SparkFun-IC-Power:V_REG_AP2112: AP2112 - 600mA CMOS LDO Regulator w/ Enable The AP2112 is CMOS process low dropout linear regulator with enable function, the regulator delivers a guaranteed 600mA (min.) continuous load current. Features Output Voltage Accuracy: ±1.5% Output Current: 600mA (Min.) Foldback Short Current Protection: 50mA Enable Function to Turn ON/OFF VOUT Low Dropout Voltage (3.3V): 250mV (Typ.) @IOUT=600mA Excellent Load Regulation: 0.2%/A (Typ.) Excellent Line Regulation: 0.02%/V (Typ.) Low Quiescent Current: 55μA (Typ.) Low Standby Current: 0.01μA (Typ.) Low Output Noise: 50μVRMS PSRR: 100Hz -65dB, 1kHz -65dB OTSD Protection Stable with 1.0μF Flexible Cap: Ceramic, Tantalum and Aluminum Electrolytic Operation Temperature Range: -40°C to 85°C ESD: MM 400V, HBM 4000V; LCSCPN#: C51118; PROD_ID: VREG-12457
R1 = Fracktal Misc Lib:R: Resistor Fixed - Generic; CATEGORY: Resistor; LCSCPN#: C25087; SUB-CATEGORY: Fixed
R2 = Fracktal Misc Lib:R: Resistor Fixed - Generic; CATEGORY: Resistor; LCSCPN#: C25086; SUB-CATEGORY: Fixed
R3 R14 R17 R19 R21 R23 = Fracktal Misc Lib:R: Resistor Fixed - Generic; CATEGORY: Resistor; LCSCPN#: C25543; SUB-CATEGORY: Fixed
R4 R24 = Fracktal Misc Lib:R: Resistor Fixed - Generic; CATEGORY: Resistor; LCSCPN#: NO-FIT; SUB-CATEGORY: Fixed
R5 = Fracktal Misc Lib:R: Resistor Fixed - Generic; CATEGORY: Resistor; LCSCPN#: C3037035; SUB-CATEGORY: Fixed
R6 = Fracktal Misc Lib:R: Resistor Fixed - Generic; CATEGORY: Resistor; LCSCPN#: C2933067; SUB-CATEGORY: Fixed
R7 R15 = Fracktal Misc Lib:R: Resistor Fixed - Generic; CATEGORY: Resistor; LCSCPN#: C25120; SUB-CATEGORY: Fixed
R8 R25 = Fracktal Misc Lib:R: Resistor Fixed - Generic; CATEGORY: Resistor; LCSCPN#: C25741; SUB-CATEGORY: Fixed
R9 = Fracktal Misc Lib:R: Resistor Fixed - Generic; CATEGORY: Resistor; LCSCPN#: C2974007; SUB-CATEGORY: Fixed
R10-R13 = SparkFun-Resistors:10KOHM1/10W1%(0603): RES-00824; PROD_ID: RES-00824
R16 = Fracktal Misc Lib:R: Resistor Fixed - Generic; CATEGORY: Resistor; LCSCPN#: C25079; SUB-CATEGORY: Fixed
R18 R20 R22 R31 = Fracktal_Misc_Lib_v26:R: Resistor Fixed - Generic; CATEGORY: Resistor; SUB-CATEGORY: Fixed
R29 R30 = Fracktal Misc Lib:R: Resistor Fixed - Generic; CATEGORY: Resistor; LCSCPN#: C31439; SUB-CATEGORY: Fixed
SJ1 SJ3 = SparkFun-Retired:SOLDERJUMPER: Solder Jumper Standard SMD solder jumper. Used to automate production. Two varients : Normally Open and Normally Closed are the same, but have different paste layers. NC will have a large amount of paste and should jumper during reflow.
U1 = 2023-03-26_17-59-48_Library:RP2040; COPYRIGHT: Copyright (C) 2023 Ultra Librarian. All rights reserved.; LCSCPN#: C2040; MANUFACTURER_PART_NUMBER: RP2040; MFR_NAME: Raspberry Pi
U2 = Fracktal Misc Lib:W25Q128JVSIQ; COPYRIGHT: Copyright (C) 2023 Ultra Librarian. All rights reserved.; LCSCPN#: C97521; MANUFACTURER_PART_NUMBER: W25Q128JVSIQ; MFR_NAME: Winbond
U3 = Fracktal Misc Lib:SN65HVD1050DR; COPYRIGHT: Copyright (C) 2023 Ultra Librarian. All rights reserved.; LCSCPN#: C14019; MANUFACTURER_PART_NUMBER: SN65HVD1050DR; MFR_NAME: Texas Instruments
USB = Fracktal Misc Lib:USB-C(KH-TYPE-C-16P): Shenzhen Kinghelm Elec KH-TYPE-C-16P LCSCPN# C709357; DATASHEET: https://datasheet.lcsc.com/lcsc/2009111434_Shenzhen-Kinghelm-Elec-KH-TYPE-C-16P_C709357.pdf; LCSCPN#: C709357; VENDOR: LCSC
X1 = Fracktal Misc Lib:CRYSTAL_TAXM12M4RLBDDT2T_3225; LCSCPN#: C133334
X2-X5 = Rembrandt Electronics - JST XH Connectors v1-0:JST-XH-04-PIN: JST XH Connector 2 Pin Wire to board connector. Pitch: 2,54 mm, (0.100") Number of pins: 4 Created by Rembrandt Electronics www.rembrandtelectronics.com
X6-X9 = Rembrandt Electronics - JST XH Connectors v1-0:JST-XH-03-PIN: JST XH Connector 2 Pin Wire to board connector. Pitch: 2,54 mm, (0.100") Number of pins: 3 Created by Rembrandt Electronics www.rembrandtelectronics.com